# Altium schematic sheet Sheet2.SchDoc
size Legal
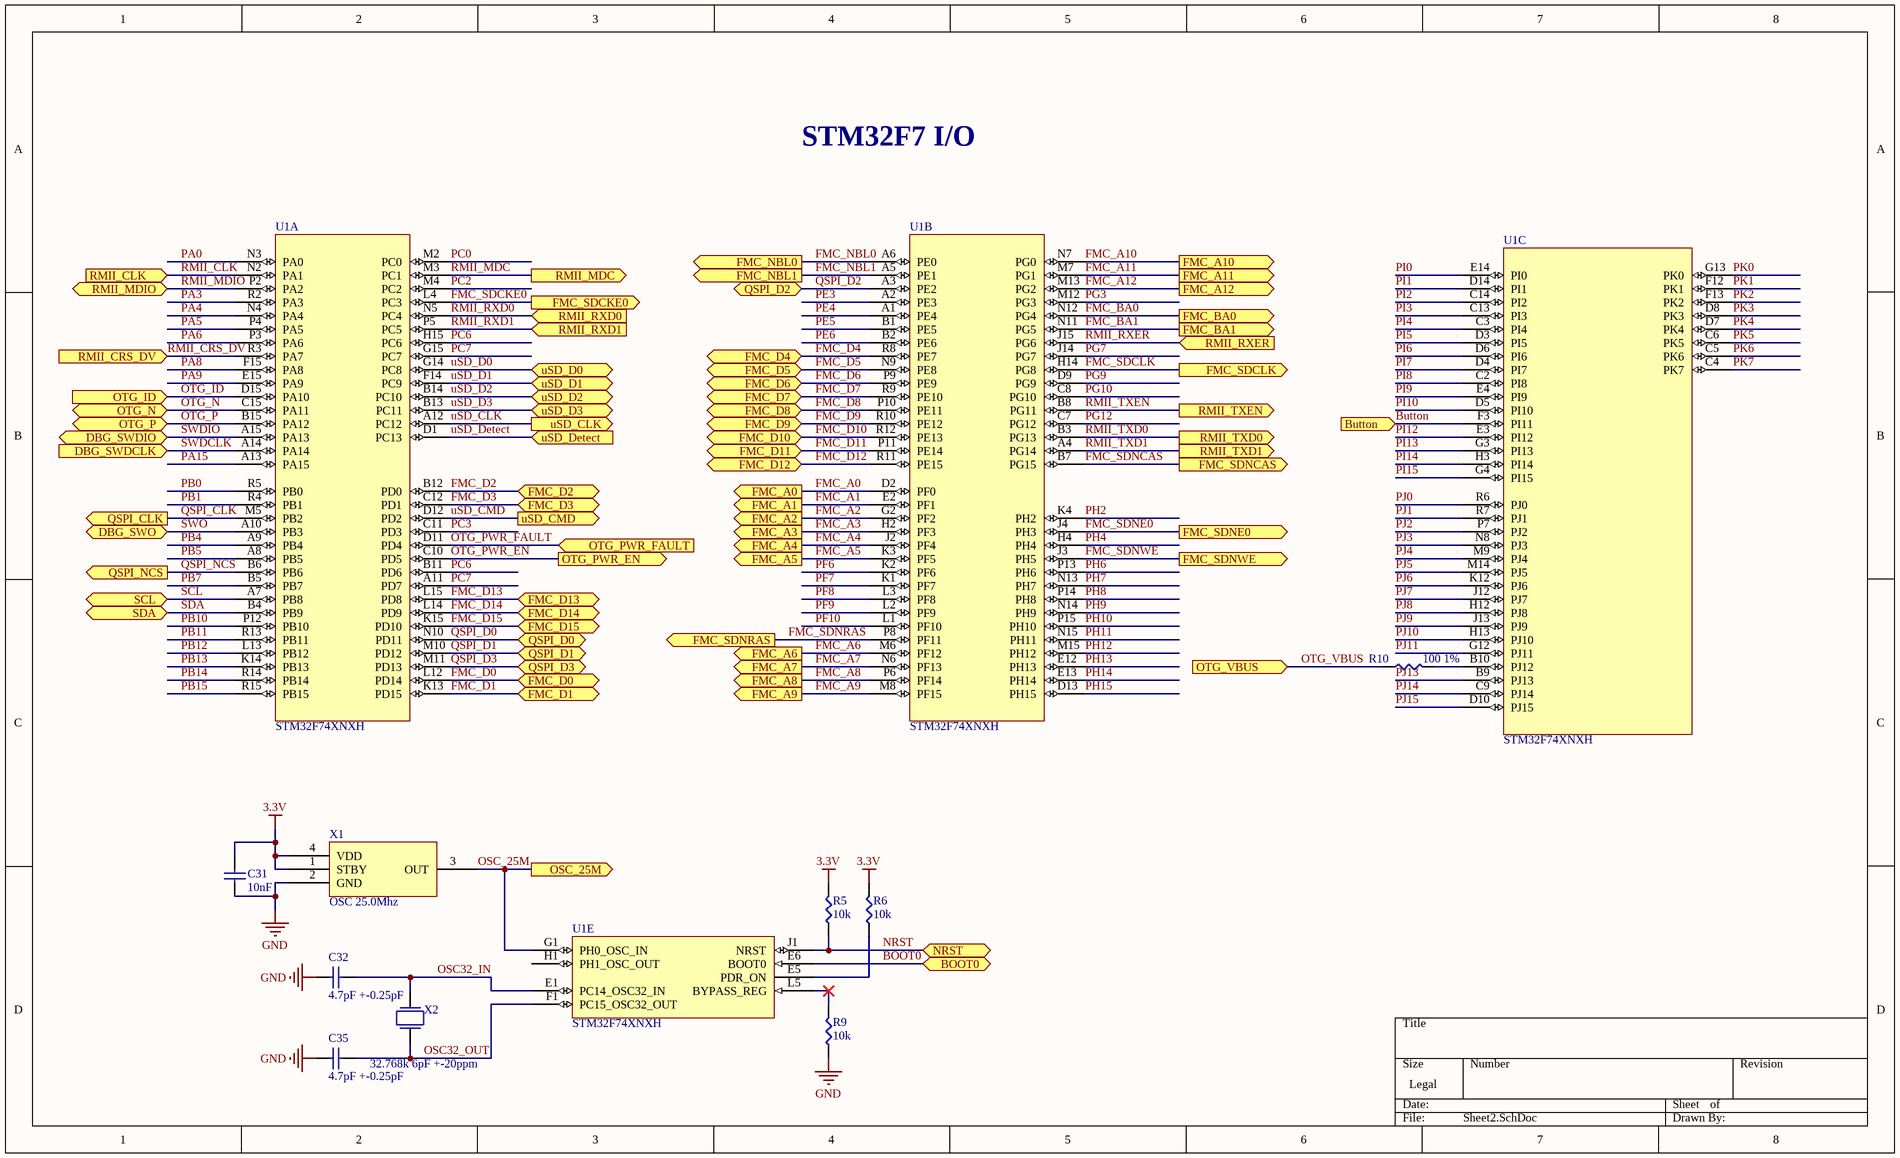
[diagram p0: Sheet2.SchDoc]

## Parts
C31  10nF  [CAP0402X04M]
C32  4.7pF +-0.25pF  [CAP0402X04M]
C35  4.7pF +-0.25pF  [CAP0402X04M]
R5  10k  [RES0402X04M]
R6  10k  [RES0402X04M]
R9  10k  [RES0402X04M]
R10  100 1%  [RES0402X04M]
U1  STM32F74XNXH  [TFBGA-216_13X13]  (parts A,B,C,E of 5)
X1  OSC 25.0Mhz  [OSC_3.2x2.5]
X2  32.768k 6pF +-20ppm  [CRYSTAL_3.20x1.50]

## Ports
BOOT0 (bidir), Button (in), DBG_SWDCLK (in), DBG_SWDIO (bidir), DBG_SWO (bidir), FMC_A0 (out), FMC_A1 (out), FMC_A2 (out), FMC_A3 (out), FMC_A4 (out), FMC_A5 (out), FMC_A6 (out), FMC_A7 (out), FMC_A8 (out), FMC_A9 (out), FMC_A10 (out), FMC_A11 (out), FMC_A12 (out), FMC_BA0 (out), FMC_BA1 (out), FMC_D0 (bidir), FMC_D1 (bidir), FMC_D2 (bidir), FMC_D3 (bidir), FMC_D4 (bidir), FMC_D5 (bidir), FMC_D6 (bidir), FMC_D7 (bidir), FMC_D8 (bidir), FMC_D9 (bidir), FMC_D10 (bidir), FMC_D11 (bidir), FMC_D12 (bidir), FMC_D13 (bidir), FMC_D14 (bidir), FMC_D15 (bidir), FMC_NBL0 (out), FMC_NBL1 (out), FMC_SDCKE0 (out), FMC_SDCLK (out), FMC_SDNCAS (out), FMC_SDNE0 (out), FMC_SDNRAS (out), FMC_SDNWE (out), NRST (bidir), OSC_25M (out), OTG_ID (in), OTG_N (bidir), OTG_P (bidir), OTG_PWR_EN (out), OTG_PWR_FAULT (in), OTG_VBUS (in), QSPI_CLK (out), QSPI_D0 (bidir), QSPI_D1 (bidir), QSPI_D2 (bidir), QSPI_D3 (bidir), QSPI_NCS (out), RMII_CLK (in), RMII_CRS_DV (in), RMII_MDC (out), RMII_MDIO (bidir), RMII_RXD0 (in), RMII_RXD1 (in), RMII_RXER (in), RMII_TXD0 (out), RMII_TXD1 (out), RMII_TXEN (out), SCL (bidir), SDA (bidir), uSD_CLK (out), uSD_CMD (out), uSD_D0 (bidir), uSD_D1 (bidir), uSD_D2 (bidir), uSD_D3 (bidir), uSD_Detect (in)

## Nets
3.3V: C31.2 R5.2 R6.2 X1.1(STBY) X1.4(VDD)
GND: C31.1 C32.1 C35.1 R9.1 X1.2(GND)
BOOT0: U1.E6(BOOT0) ; port BOOT0
Button: U1.F3(PI11) ; port Button
FMC_A0: U1.D2(PF0) ; port FMC_A0
FMC_A1: U1.E2(PF1) ; port FMC_A1
FMC_A2: U1.G2(PF2) ; port FMC_A2
FMC_A3: U1.H2(PF3) ; port FMC_A3
FMC_A4: U1.J2(PF4) ; port FMC_A4
FMC_A5: U1.K3(PF5) ; port FMC_A5
FMC_A6: U1.M6(PF12) ; port FMC_A6
FMC_A7: U1.N6(PF13) ; port FMC_A7
FMC_A8: U1.P6(PF14) ; port FMC_A8
FMC_A9: U1.M8(PF15) ; port FMC_A9
FMC_A10: U1.N7(PG0) ; port FMC_A10
FMC_A11: U1.M7(PG1) ; port FMC_A11
FMC_A12: U1.M13(PG2) ; port FMC_A12
FMC_BA0: U1.N12(PG4) ; port FMC_BA0
FMC_BA1: U1.N11(PG5) ; port FMC_BA1
FMC_D0: U1.L12(PD14) ; port FMC_D0
FMC_D1: U1.K13(PD15) ; port FMC_D1
FMC_D2: U1.B12(PD0) ; port FMC_D2
FMC_D3: U1.C12(PD1) ; port FMC_D3
FMC_D4: U1.R8(PE7) ; port FMC_D4
FMC_D5: U1.N9(PE8) ; port FMC_D5
FMC_D6: U1.P9(PE9) ; port FMC_D6
FMC_D7: U1.R9(PE10) ; port FMC_D7
FMC_D8: U1.P10(PE11) ; port FMC_D8
FMC_D9: U1.R10(PE12) ; port FMC_D9
FMC_D10: U1.R12(PE13) ; port FMC_D10
FMC_D11: U1.P11(PE14) ; port FMC_D11
FMC_D12: U1.R11(PE15) ; port FMC_D12
FMC_D13: U1.L15(PD8) ; port FMC_D13
FMC_D14: U1.L14(PD9) ; port FMC_D14
FMC_D15: U1.K15(PD10) ; port FMC_D15
FMC_NBL0: U1.A6(PE0) ; port FMC_NBL0
FMC_NBL1: U1.A5(PE1) ; port FMC_NBL1
FMC_SDCKE0: U1.L4(PC3) ; port FMC_SDCKE0
FMC_SDCLK: U1.H14(PG8) ; port FMC_SDCLK
FMC_SDNCAS: U1.B7(PG15) ; port FMC_SDNCAS
FMC_SDNE0: U1.J4(PH3) ; port FMC_SDNE0
FMC_SDNRAS: U1.P8(PF11) ; port FMC_SDNRAS
FMC_SDNWE: U1.J3(PH5) ; port FMC_SDNWE
NRST: R5.1 U1.J1(NRST) ; port NRST
OSC32_IN: C32.2 U1.E1(PC14_OSC32_IN) X2.1
OSC32_OUT: C35.2 U1.F1(PC15_OSC32_OUT) X2.2
OSC_25M: U1.G1(PH0_OSC_IN) X1.3(OUT) ; port OSC_25M
OTG_ID: U1.D15(PA10) ; port OTG_ID
OTG_N: U1.C15(PA11) ; port OTG_N
OTG_P: U1.B15(PA12) ; port OTG_P
OTG_PWR_EN: U1.C10(PD5) ; port OTG_PWR_EN
OTG_PWR_FAULT: U1.D11(PD4) ; port OTG_PWR_FAULT
OTG_VBUS: R10.1 ; port OTG_VBUS
PA0: U1.N3(PA0)
PA3: U1.R2(PA3)
PA4: U1.N4(PA4)
PA5: U1.P4(PA5)
PA6: U1.P3(PA6)
PA8: U1.F15(PA8)
PA9: U1.E15(PA9)
PA15: U1.A13(PA15)
PB0: U1.R5(PB0)
PB1: U1.R4(PB1)
PB4: U1.A9(PB4)
PB5: U1.A8(PB5)
PB7: U1.B5(PB7)
PB10: U1.P12(PB10)
PB11: U1.R13(PB11)
PB12: U1.L13(PB12)
PB13: U1.K14(PB13)
PB14: U1.R14(PB14)
PB15: U1.R15(PB15)
PC0: U1.M2(PC0)
PC2: U1.M4(PC2)
PC3: U1.C11(PD3)
PC6: U1.B11(PD6) U1.H15(PC6)
PC7: U1.A11(PD7) U1.G15(PC7)
PE3: U1.A2(PE3)
PE4: U1.A1(PE4)
PE5: U1.B1(PE5)
PE6: U1.B2(PE6)
PF6: U1.K2(PF6)
PF7: U1.K1(PF7)
PF8: U1.L3(PF8)
PF9: U1.L2(PF9)
PF10: U1.L1(PF10)
PG3: U1.M12(PG3)
PG7: U1.J14(PG7)
PG9: U1.D9(PG9)
PG10: U1.C8(PG10)
PG12: U1.C7(PG12)
PH2: U1.K4(PH2)
PH4: U1.H4(PH4)
PH6: U1.P13(PH6)
PH7: U1.N13(PH7)
PH8: U1.P14(PH8)
PH9: U1.N14(PH9)
PH10: U1.P15(PH10)
PH11: U1.N15(PH11)
PH12: U1.M15(PH12)
PH13: U1.E12(PH13)
PH14: U1.E13(PH14)
PH15: U1.D13(PH15)
PI0: U1.E14(PI0)
PI1: U1.D14(PI1)
PI2: U1.C14(PI2)
PI3: U1.C13(PI3)
PI4: U1.C3(PI4)
PI5: U1.D3(PI5)
PI6: U1.D6(PI6)
PI7: U1.D4(PI7)
PI8: U1.C2(PI8)
PI9: U1.E4(PI9)
PI10: U1.D5(PI10)
PI12: U1.E3(PI12)
PI13: U1.G3(PI13)
PI14: U1.H3(PI14)
PI15: U1.G4(PI15)
PJ0: U1.R6(PJ0)
PJ1: U1.R7(PJ1)
PJ2: U1.P7(PJ2)
PJ3: U1.N8(PJ3)
PJ4: U1.M9(PJ4)
PJ5: U1.M14(PJ5)
PJ6: U1.K12(PJ6)
PJ7: U1.J12(PJ7)
PJ8: U1.H12(PJ8)
PJ9: U1.J13(PJ9)
PJ10: U1.H13(PJ10)
PJ11: U1.G12(PJ11)
PJ13: U1.B9(PJ13)
PJ14: U1.C9(PJ14)
PJ15: U1.D10(PJ15)
PK0: U1.G13(PK0)
PK1: U1.F12(PK1)
PK2: U1.F13(PK2)
PK3: U1.D8(PK3)
PK4: U1.D7(PK4)
PK5: U1.C6(PK5)
PK6: U1.C5(PK6)
PK7: U1.C4(PK7)
QSPI_CLK: U1.M5(PB2) ; port QSPI_CLK
QSPI_D0: U1.N10(PD11) ; port QSPI_D0
QSPI_D1: U1.M10(PD12) ; port QSPI_D1
QSPI_D2: U1.A3(PE2) ; port QSPI_D2
QSPI_D3: U1.M11(PD13) ; port QSPI_D3
QSPI_NCS: U1.B6(PB6) ; port QSPI_NCS
RMII_CLK: U1.N2(PA1) ; port RMII_CLK
RMII_CRS_DV: U1.R3(PA7) ; port RMII_CRS_DV
RMII_MDC: U1.M3(PC1) ; port RMII_MDC
RMII_MDIO: U1.P2(PA2) ; port RMII_MDIO
RMII_RXD0: U1.N5(PC4) ; port RMII_RXD0
RMII_RXD1: U1.P5(PC5) ; port RMII_RXD1
RMII_RXER: U1.J15(PG6) ; port RMII_RXER
RMII_TXD0: U1.B3(PG13) ; port RMII_TXD0
RMII_TXD1: U1.A4(PG14) ; port RMII_TXD1
RMII_TXEN: U1.B8(PG11) ; port RMII_TXEN
SCL: U1.A7(PB8) ; port SCL
SDA: U1.B4(PB9) ; port SDA
SWDCLK: U1.A14(PA14) ; port DBG_SWDCLK
SWDIO: U1.A15(PA13) ; port DBG_SWDIO
SWO: U1.A10(PB3) ; port DBG_SWO
uSD_CLK: U1.A12(PC12) ; port uSD_CLK
uSD_CMD: U1.D12(PD2) ; port uSD_CMD
uSD_D0: U1.G14(PC8) ; port uSD_D0
uSD_D1: U1.F14(PC9) ; port uSD_D1
uSD_D2: U1.B14(PC10) ; port uSD_D2
uSD_D3: U1.B13(PC11) ; port uSD_D3
uSD_Detect: U1.D1(PC13) ; port uSD_Detect
NetR6_1: R6.1 U1.E5(PDR_ON)
NetR9_2: R9.2 U1.L5(BYPASS_REG)
NetR10_2: R10.2 U1.B10(PJ12)

Not connected (* = marked no-connect by the designer): U1 H1(PH1_OSC_OUT)

## Notes on the sheet
- STM32F7 I/O

## Library data of the parts
C31 = GRM155R71H103KA88D: CAP CER 10000PF 50V X7R 0402; Manufacturer: Murata Electronics North America; Tolerance: ±10%; Supplier 1: Digi-Key; Manufacturer Part Number: GRM155R71H103KA88D; RoHS: RoHS Compliant; Category: Capacitors; Stock 1: 4828857; Pricing 1: 1=0.1, 50=0.0052, 100=0.0044, 250=0.0036, 500=0.00308, 1000=0.0024, 5000=0.002 (USD); Packaging: Cut Tape (CT); Part Status: Active; Capacitance: 10000pF; Voltage - Rated: 50V; Temperature Coefficient: X7R; Operating Temperature: -55°C ~ 125°C; Features: -; Ratings: -; Applications: General Purpose; Failure Rate: *; Mounting Type: Surface Mount, MLCC; Package / Case: 0402 (1005 Metric); Size / Dimension: 0.039" L x 0.020" W (1.00mm x 0.50mm); Height - Seated (Max): -; Thickness (Max): 0.022" (0.55mm); Lead Spacing: -; Lead Style: -; ComponentLink1URL: http://www.murata.com/~/media/webrenewal/support/library/catalog/products/capacitor/mlcc/c02e.pdf; ComponentLink1Description: http://www.murata.com/~/media/webrenewal/support/library/catalog/products/capacitor/mlcc/c02e.pdf; Supplier Part Number 1: 490-4516-1-ND
C32 C35 = CL05C4R7CB5NNNC: CAP CER 4.7PF 50V NP0 0402; Manufacturer: Samsung Electro-Mechanics America, Inc.; Tolerance: ±0.25pF; Temperature Coefficient: C0G, NP0; Supplier 1: Digi-Key; Manufacturer Part Number: CL05C4R7CB5NNNC; RoHS: RoHS Compliant; Category: Capacitors; Stock 1: 159620; Pricing 1: 1=0.1, 10=0.015, 25=0.0112, 50=0.0084, 100=0.0069, 250=0.00576, 500=0.0049, 1000=0.00385, 5000=0.00322 (USD); Packaging: Cut Tape (CT); Part Status: Active; Capacitance: 4.7pF; Voltage - Rated: 50V; Operating Temperature: -55°C ~ 125°C; Features: -; Ratings: -; Applications: General Purpose; Failure Rate: *; Mounting Type: Surface Mount, MLCC; Package / Case: 0402 (1005 Metric); Size / Dimension: 0.039" L x 0.020" W (1.00mm x 0.50mm); Height - Seated (Max): -; Thickness (Max): 0.022" (0.55mm); Lead Spacing: -; Lead Style: -; ComponentLink1URL: http://www.samsungsem.com/kr/support/product-search/mlcc/__icsFiles/afieldfile/2016/08/18/S_CL05C4R7CB5NNNC.pdf; ComponentLink1Description: http://www.samsungsem.com/kr/support/product-search/mlcc/__icsFiles/afieldfile/2016/08/18/S_CL05C4R7CB5NNNC.pdf; Supplier Part Number 1: 1276-1703-1-ND
R5 R6 R9 = RC0402FR-0710KL: RES SMD 10K OHM 1% 1/16W 0402; Manufacturer: Yageo; Power (Watts): 0.063W, 1/16W; Temperature Coefficient: ±100ppm/°C; Supplier 1: Digi-Key; Manufacturer Part Number: RC0402FR-0710KL; RoHS: RoHS Compliant; Category: Resistors; Stock 1: 13115833; Pricing 1: 1=0.1, 10=0.013, 25=0.0096, 100=0.0054, 250=0.00412, 500=0.00328, 1000=0.00242, 2500=0.0021, 5000=0.00173 (USD); Packaging: Cut Tape (CT); Part Status: Active; Resistance (Ohms): 10k; Tolerance: ±1%; Composition: Thick Film; Features: Moisture Resistant; Operating Temperature: -55°C ~ 155°C; Package / Case: 0402 (1005 Metric); Supplier Device Package: 0402; Size / Dimension: 0.039" L x 0.020" W (1.00mm x 0.50mm); Height - Seated (Max): 0.016" (0.40mm); Number of Terminations: 2; Failure Rate: -; ComponentLink1URL: http://www.yageo.com/NewPortal/yageodocoutput?fileName=/pdf/R-Chip/PYu-RC_Group_51_RoHS_L_4.pdf; ComponentLink1Description: http://www.yageo.com/NewPortal/yageodocoutput?fileName=/pdf/R-Chip/PYu-RC_Group_51_RoHS_L_4.pdf; Supplier Part Number 1: 311-10.0KLRCT-ND
R10 = RC0402FR-07100RL: RES SMD 100 OHM 1% 1/16W 0402; Manufacturer: Yageo; Resistance (Ohms): 100; Power (Watts): 0.063W, 1/16W; Temperature Coefficient: ±100ppm/°C; Supplier 1: Digi-Key; Manufacturer Part Number: RC0402FR-07100RL; RoHS: RoHS Compliant; Category: Resistors; Stock 1: 4498031; Pricing 1: 1=0.1, 10=0.013, 25=0.0096, 100=0.0054, 250=0.00412, 500=0.00328, 1000=0.00242, 2500=0.0021, 5000=0.00173 (USD); Packaging: Cut Tape (CT); Part Status: Active; Tolerance: ±1%; Composition: Thick Film; Features: Moisture Resistant; Operating Temperature: -55°C ~ 155°C; Package / Case: 0402 (1005 Metric); Supplier Device Package: 0402; Size / Dimension: 0.039" L x 0.020" W (1.00mm x 0.50mm); Height - Seated (Max): 0.016" (0.40mm); Number of Terminations: 2; Failure Rate: -; ComponentLink1URL: http://www.yageo.com/NewPortal/yageodocoutput?fileName=/pdf/R-Chip/PYu-RC_Group_51_RoHS_L_4.pdf; ComponentLink1Description: http://www.yageo.com/NewPortal/yageodocoutput?fileName=/pdf/R-Chip/PYu-RC_Group_51_RoHS_L_4.pdf; Supplier Part Number 1: 311-100LRCT-ND
U1 = STM32F74XNXH: Imported; Manufacturer Part Number: STM32F746NGH6; Vendor: STMicroelectronics; C: Copyright (C) 2016 Accelerated Designs. All rights reserved; Core Processor: ARM® Cortex®-M7; Core Size: 32-Bit; Speed: 216MHz; Connectivity: CAN, EBI/EMI, Ethernet, I²C, IrDA, LIN, SAI, SD, SPDIF-Rx, SPI, UART/USART, USB OTG; Peripherals: Brown-out Detect/Reset, DMA, I²S, LCD, POR, PWM, WDT; Number of I/O: 168; Program Memory Size: 1MB (1M x 8); Program Memory Type: FLASH; RAM Size: 320K x 8; Voltage - Supply (Vcc/Vdd): 1.7 V ~ 3.6 V; Data Converters: A/D 24x12b, D/A 2x12b; Oscillator Type: Internal; Copyright: Copyright (C) 2016 Accelerated Designs. All rights reserved; RefDes: RefDes; Type: Type; Value: Value; Supplier 1: Digi-Key; Manufacturer: STMicroelectronics; RoHS: RoHS Compliant; Category: Integrated Circuits (ICs); Stock 1: 825; Pricing 1: 1=17.07, 10=15.687, 100=13.2486, 500=11.7856 (USD); Packaging: Tray; Part Status: Active; EEPROM Size: -; Operating Temperature: -40°C ~ 85°C (TA); Package / Case: 216-TFBGA; Supplier Device Package: 216-TFBGA (13x13); ComponentLink1Description: http://www.st.com/content/ccc/resource/technical/document/datasheet/96/ed/61/9b/e0/6c/45/0b/DM00166116.pdf/files/DM00166116.pdf/jcr:content/translations/en.DM00166116.pdf; Supplier Part Number 1: 497-15818-ND
X1 = ASEMB-25.000MHZ-LC-T: OSC MEMS 25.000MHZ CMOS SMD; Manufacturer: Abracon LLC; Frequency: 25MHz; Function: Enable/Disable; Voltage - Supply: 1.8 V ~ 3.3 V; Frequency Stability: ±50ppm; Current - Supply (Max): 16mA; Current - Supply (Disable) (Max): 15µA; Supplier 1: Digi-Key; Manufacturer Part Number: ASEMB-25.000MHZ-LC-T; RoHS: RoHS Compliant; Category: Crystals, Oscillators, Resonators; Stock 1: 27584; Pricing 1: 1=1.14, 10=1.088, 50=1.0626, 100=0.9108, 500=0.8855 (USD); Packaging: Cut Tape (CT); Part Status: Active; Type: MEMS (Silicon); Output: CMOS; Operating Temperature: -40°C ~ 85°C; Ratings: -; Mounting Type: Surface Mount; Package / Case: 4-SMD, No Lead (DFN, LCC); Size / Dimension: 0.126" L x 0.098" W (3.20mm x 2.50mm); Height - Seated (Max): 0.035" (0.90mm); ComponentLink1URL: http://www.abracon.com/Oscillators/ASEMB.pdf; ComponentLink1Description: http://www.abracon.com/Oscillators/ASEMB.pdf; Supplier Part Number 1: 535-11750-1-ND
X2 = NX3215SA-32.768K-STD-MUA-14: CRYSTAL 32.7680KHZ 6PF SMD; Manufacturer: NDK; Frequency: 32.768kHz; Frequency Tolerance: ±20ppm; ESR (Equivalent Series Resistance): 70 kOhm; Operating Mode: Fundamental; Supplier 1: Digi-Key; Manufacturer Part Number: NX3215SA-32.768K-STD-MUA-14; RoHS: RoHS Compliant; Category: Crystals, Oscillators, Resonators; Stock 1: 5426; Pricing 1: 1=0.94, 10=0.835, 50=0.7804, 100=0.6897, 500=0.6534, 1000=0.5445 (USD); Packaging: Cut Tape (CT); Part Status: Active; Type: kHz Crystal (Tuning Fork); Frequency Stability: -; Load Capacitance: 6pF; Operating Temperature: -40°C ~ 85°C; Ratings: -; Mounting Type: Surface Mount; Package / Case: 2-SMD; Size / Dimension: 0.126" L x 0.059" W (3.20mm x 1.50mm); Height - Seated (Max): 0.035" (0.90mm); ComponentLink1URL: http://www.ndk.com/images/products/catalog/c_NX3215SA-STD-MUA-14_e.pdf; ComponentLink1Description: http://www.ndk.com/images/products/catalog/c_NX3215SA-STD-MUA-14_e.pdf; Supplier Part Number 1: 644-1171-1-ND